# Altium project Acoustics Board.PrjPcb (part 1 of 2)
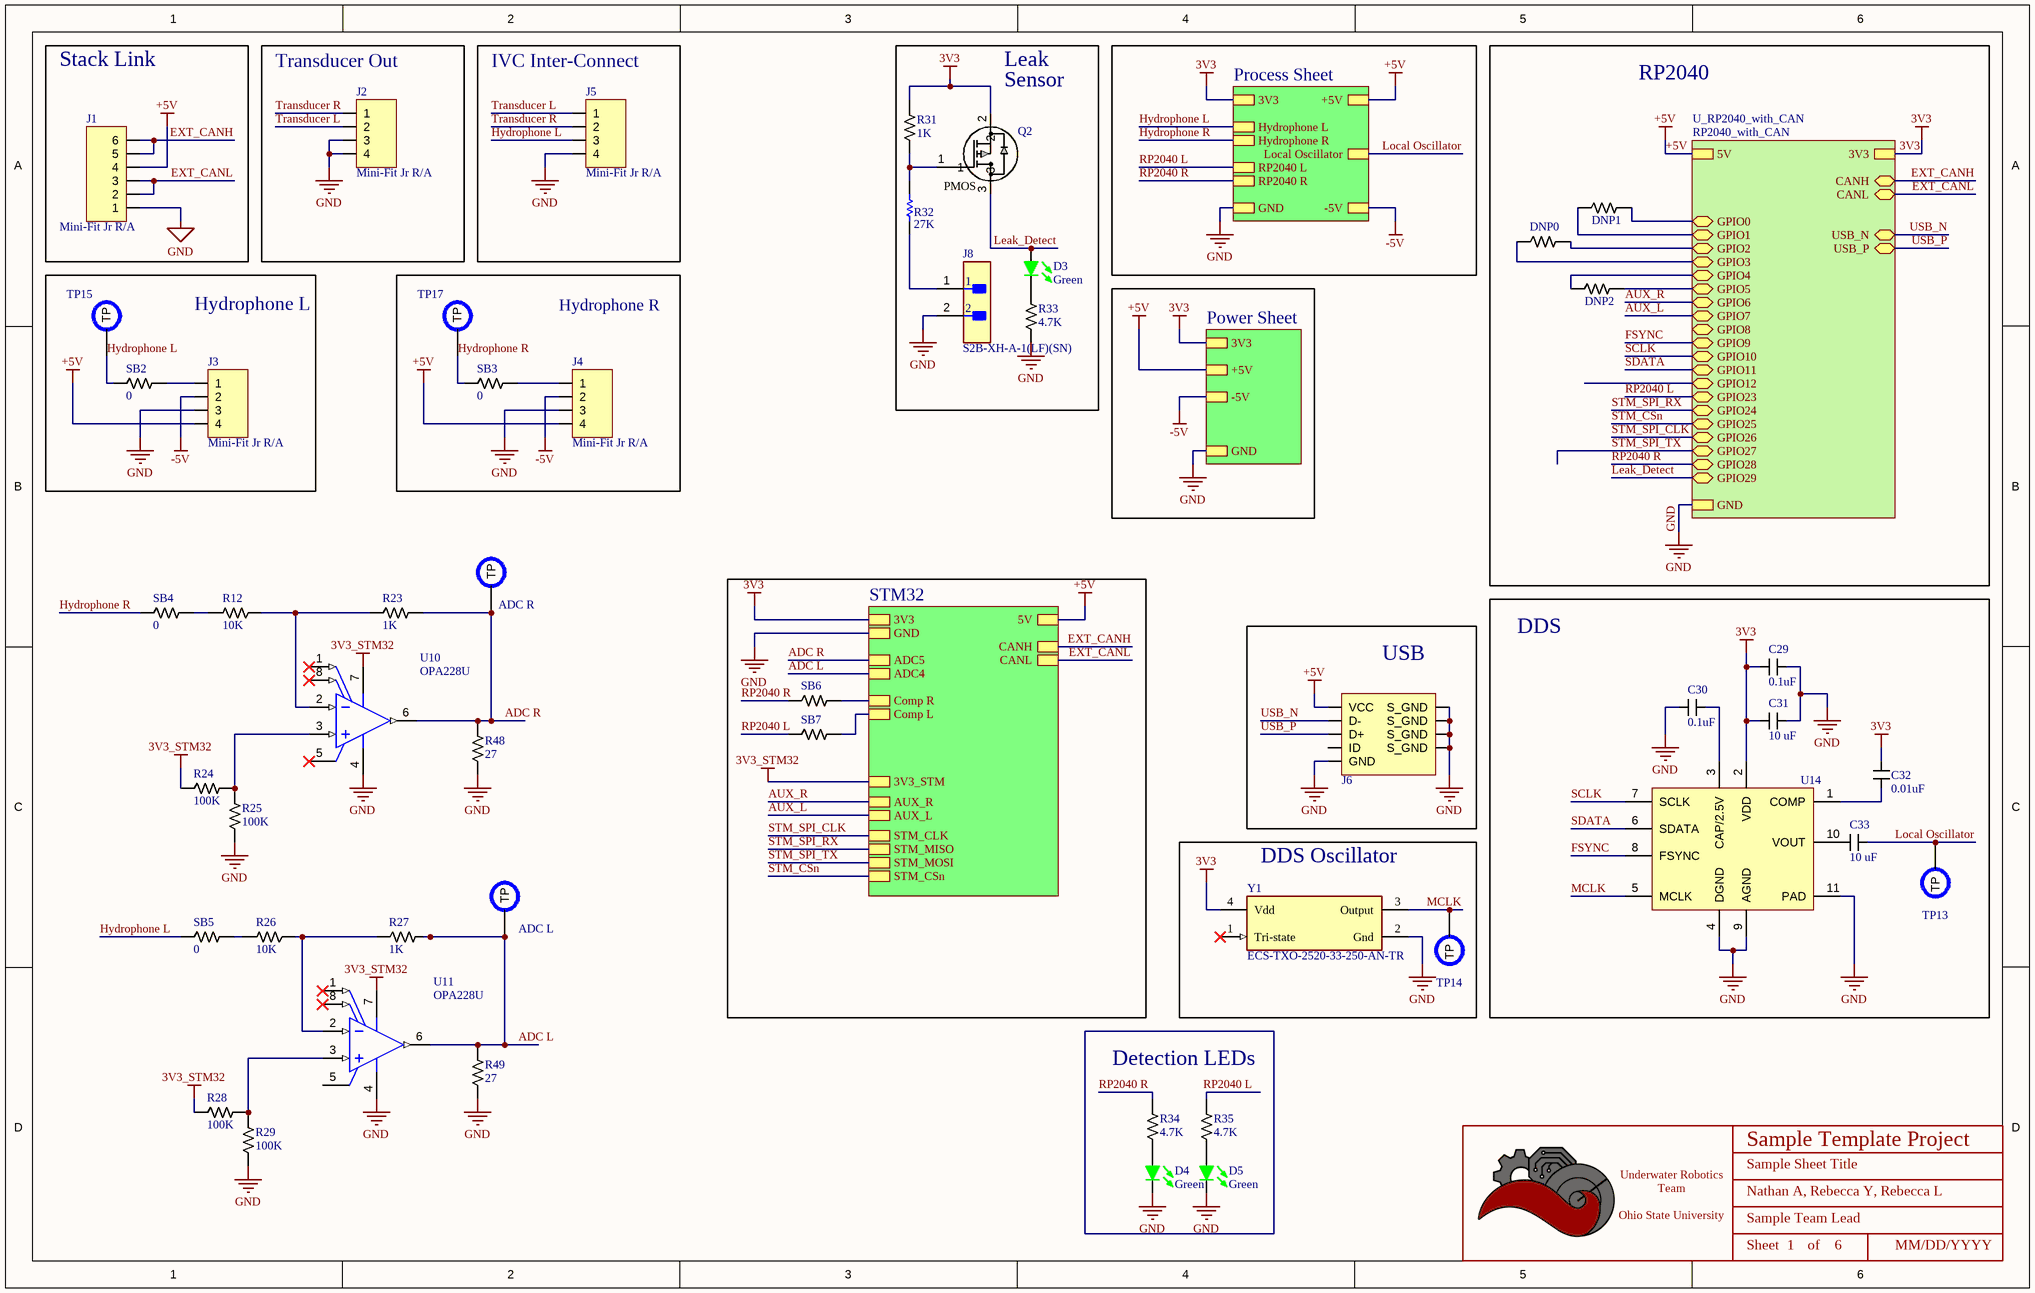
[diagram p0: [Acoustics] Connections & RP2040.SchDoc]
BoardRevision: 1.0; DateOfDesignReview: XX/XX/XXXX; ProjectTitle: Sample Template Project; TeamLead: Sample Team Lead
4 sheets, 201 parts. Net scope: strictly hierarchical (ports join the sheet entries above them; power ports are local).
Board file: Acoustics Board.PcbDoc
Sheets:
  [Acoustics] Connections & RP2040.SchDoc
    Process Sheet = [Acoustics] Hydrophone Process.SchDoc
    Power Sheet = [Acoustics] Power.SchDoc
    STM32 = [Acoustics] STM32G4.SchDoc

## Sheet [Acoustics] Connections & RP2040.SchDoc: Sample Sheet Title
size B; Date: MM/DD/YYYY; Author: Nathan A, Rebecca Y, Rebecca L; Organization: ORGANIZATION; Address1: ADDRESS 1; Address2: ADDRESS 2; Address3: ADDRESS 3; Address4: ADDRESS 4; Revision: -; SheetNumber: 1; SheetTotal: 6; ENG_APP_DATE: --/--/--; DSN_APP_DATE: --/--/--; CHK_APP_DATE: --/--/--

### Parts
(Parts that share a designator on the sheet are numbered #1, #2 ... from top to bottom, then left to right.)
*#1  Title_Block  [LOGO]  (value not drawn)  (graphical)
ADC_L  PCB Test Point  [TESTPOINT_1.2MM]  (value not drawn)  (no BOM)
ADC_R  PCB Test Point  [TESTPOINT_1.2MM]  (value not drawn)  (no BOM)
C29  value 0.1uF  [CAPACITOR_0603]  (hidden comment: 100nF Ceramic 6.3V)
C30  value 0.1uF  [CAPACITOR_0603]  (hidden comment: 100nF Ceramic 6.3V)
C31  Value (uF): 10 uF  [CAPACITOR_0603]  (hidden comment: 10uF Ceramic 6.3V)
C32  value 0.01uF  [CAPACITOR_0603]  (hidden comment: CL10B103KB8NNNC)
C33  Value (uF): 10 uF  [CAPACITOR_0603]  (hidden comment: 10uF Ceramic 6.3V)
D3  Color: Green  [LED_0603]  (hidden comment: IN-S63AT5G)
D4  Color: Green  [LED_0603]  (hidden comment: IN-S63AT5G)
D5  Color: Green  [LED_0603]  (hidden comment: IN-S63AT5G)
DNP0  DNP  [RESISTOR_0402]  (value not drawn)
DNP1  DNP  [RESISTOR_0402]  (value not drawn)
DNP2  DNP  [RESISTOR_0402]  (value not drawn)
J1  Mini-Fit Jr R/A  [CONN_MOLEX_MINIFIT JR_6 POS_R/A]
J2  Mini-Fit Jr R/A  [CONN_MOLEX_MINIFIT JR_4 POS_R/A]
J3  Mini-Fit Jr R/A  [CONN_MOLEX_MINIFIT JR_4 POS_R/A]
J4  Mini-Fit Jr R/A  [CONN_MOLEX_MINIFIT JR_4 POS_R/A]
J5  Mini-Fit Jr R/A  [CONN_MOLEX_MINIFIT JR_4 POS_R/A]
J6  USB_MICRO R/A  [CONN_MINIUSB]  (value not drawn)
J8  S2B-XH-A-1(LF)(SN)  [FP-S2B-XH-A-1_LF_SN-MFG]
Q2  MOSFET P-CHANNEL 20V 4.7A SOT23  [SOT-23-3]  (value not drawn)
R12  Value  (Ohms): 10K  [RESISTOR_0603]  (hidden comment: 10k Ohm 5% 1/10W)
R23  Value  (Ohms): 1K  [RESISTOR_0603]  (hidden comment: 1k Ohm 5% 1/8W)
R24  Value  (Ohms): 100K  [RESISTOR_0603]  (hidden comment: 100k Ohm 5% 1/8W)
R25  Value  (Ohms): 100K  [RESISTOR_0603]  (hidden comment: 100k Ohm 5% 1/8W)
R26  Value  (Ohms): 10K  [RESISTOR_0603]  (hidden comment: 10k Ohm 5% 1/10W)
R27  Value  (Ohms): 1K  [RESISTOR_0603]  (hidden comment: 1k Ohm 5% 1/8W)
R28  Value  (Ohms): 100K  [RESISTOR_0603]  (hidden comment: 100k Ohm 5% 1/8W)
R29  Value  (Ohms): 100K  [RESISTOR_0603]  (hidden comment: 100k Ohm 5% 1/8W)
R31  Value  (Ohms): 1K  [RESISTOR_0402]  (hidden comment: 1k Ohm 1% 1/16W)
R32  27K  [RESC1005X40X25ML05T05]
R33  Value  (Ohms): 4.7K  [RESISTOR_0603]  (hidden comment: 4.7k Ohm 5% 1/10W)
R34  Value  (Ohms): 4.7K  [RESISTOR_0603]  (hidden comment: 4.7k Ohm 5% 1/10W)
R35  Value  (Ohms): 4.7K  [RESISTOR_0603]  (hidden comment: 4.7k Ohm 5% 1/10W)
R48  Value  (Ohms): 27  [RESISTOR_0603]  (hidden comment: 27 Ohm 5% 1/8W)
R49  Value  (Ohms): 27  [RESISTOR_0603]  (hidden comment: 27 Ohm 5% 1/8W)
SB2  Value  (Ohms): 0  [RESISTOR_0603]  (hidden comment: 0 Ohm Jumper No Fit)
SB3  Value  (Ohms): 0  [RESISTOR_0603]  (hidden comment: 0 Ohm Jumper No Fit)
SB4  Value  (Ohms): 0  [RESISTOR_0603]  (hidden comment: 0 Ohm Jumper No Fit)
SB5  Value  (Ohms): 0  [RESISTOR_0603]  (hidden comment: 0 Ohm Jumper No Fit)
SB6  0 Ohm Jumper No Fit  [RESISTOR_0603]  (value not drawn)
SB7  0 Ohm Jumper No Fit  [RESISTOR_0603]  (value not drawn)
TP13  PCB Test Point  [TESTPOINT_1.2MM]  (value not drawn)  (no BOM)
TP14  PCB Test Point  [TESTPOINT_1.2MM]  (value not drawn)  (no BOM)
TP15  PCB Test Point  [TESTPOINT_1.2MM]  (value not drawn)  (no BOM)
TP17  PCB Test Point  [TESTPOINT_1.2MM]  (value not drawn)  (no BOM)
U10  OPA228U  [D0008A_M]
U11  OPA228U  [D0008A_M]
U14  IC DDS 5MHZ 10BIT 10LFCSP  [CP-10-9]  (value not drawn)
Y1  ECS-TXO-2520-33-250-AN-TR  [FP-ECS-TXO-2520-MFG]

### Blocks framed on the sheet
Stack Link: J1
Transducer Out: J2
IVC Inter-Connect: J5
RP2040: DNP0-DNP2
Hydrophone L: J3 SB2 TP15
Hydrophone R: J4 SB3 TP17
DDS: C29-C33 TP13 U14
USB: J6
DDS Oscillator: TP14 Y1

### Sub-sheets
Power Sheet = [Acoustics] Power.SchDoc: 3V3, -5V, GND, +5V
Process Sheet = [Acoustics] Hydrophone Process.SchDoc: Hydrophone L, Hydrophone R, RP2040 L, RP2040 R, 3V3, +5V, -5V, GND, Local Oscillator
STM32 = [Acoustics] STM32G4.SchDoc: 3V3, GND, ADC5, ADC4, 5V, CANH, CANL, Comp R, Comp L, 3V3_STM, AUX_R, AUX_L, STM_CLK, STM_MISO, STM_MOSI, STM_CSn
U_RP2040_with_CAN = RP2040_with_CAN (file not in this document): USB_P (bidir), USB_N (bidir), 5V, CANH (bidir), CANL (bidir), GPIO0 (bidir), GPIO1 (bidir), GPIO2 (bidir), GPIO3 (bidir), GPIO4 (bidir), GPIO5 (bidir), GPIO6 (bidir), GPIO7 (bidir), GPIO8 (bidir), GPIO9 (bidir), GPIO10 (bidir), GPIO11 (bidir), GPIO12 (bidir), GPIO23 (bidir), GPIO24 (bidir), GPIO25 (bidir), GPIO26 (bidir), GPIO27 (bidir), GPIO28 (bidir), GPIO29 (bidir), 3V3, GND

### Nets
3V3: C29.2 C31.1 C32.1 Q2.2 R31.1 U14.2(VDD) Y1.4(Vdd) ; sheet U_RP2040_with_CAN/3V3, sheet Process Sheet/3V3, sheet Power Sheet/3V3, sheet STM32/3V3
3V3_STM32: R24.2 R28.2 U10.7(V+) U11.7(V+) ; sheet STM32/3V3_STM
+5V: J1.4 J3.4 J4.4 J6.1(VCC) ; sheet U_RP2040_with_CAN/5V, sheet Process Sheet/+5V, sheet Power Sheet/+5V, sheet STM32/5V
-5V: J3.2 J4.2 ; sheet Process Sheet/-5V, sheet Power Sheet/-5V
GND: C29.1 C30.1 C31.2 D4.2 D5.2 J1.1 J2.3 J2.4 J3.3 J4.3 J5.4 J6.5(GND) J6.6(S_GND) J6.7(S_GND) J6.8(S_GND) J6.9(S_GND) J8.2 R25.2 R29.2 R33.2 R48.2 R49.2 U10.4(V-) U11.4(V-) U14.4(DGND) U14.9(AGND) U14.11(PAD) Y1.2(Gnd) ; sheet U_RP2040_with_CAN/GND, sheet Process Sheet/GND, sheet Power Sheet/GND, sheet STM32/GND
ADC L: ADC_L.TP R27.1 R49.1 U11.6(OUT) ; sheet STM32/ADC4
ADC R: ADC_R.TP R23.1 R48.1 U10.6(OUT) ; sheet STM32/ADC5
AUX_L: sheet U_RP2040_with_CAN/GPIO7, sheet STM32/AUX_L
AUX_R: sheet U_RP2040_with_CAN/GPIO6, sheet STM32/AUX_R
EXT_CANH: J1.5 J1.6 ; sheet U_RP2040_with_CAN/CANH, sheet STM32/CANH  [project net CANH_STM]
EXT_CANL: J1.2 J1.3 ; sheet U_RP2040_with_CAN/CANL, sheet STM32/CANL  [project net CANL_STM]
FSYNC: U14.8(FSYNC) ; sheet U_RP2040_with_CAN/GPIO9
Hydrophone L: J5.3 SB2.2 SB5.2 TP15.TP ; sheet Process Sheet/Hydrophone L
Hydrophone R: SB3.2 SB4.2 TP17.TP ; sheet Process Sheet/Hydrophone R
Leak_Detect: D3.1 Q2.3 ; sheet U_RP2040_with_CAN/GPIO29
Local Oscillator: C33.2 TP13.TP ; sheet Process Sheet/Local Oscillator
MCLK: TP14.TP U14.5(MCLK) Y1.3(Output)
RP2040 L: R35.1 SB7.2 ; sheet U_RP2040_with_CAN/GPIO23, sheet Process Sheet/RP2040 L
RP2040 R: R34.1 SB6.2 ; sheet U_RP2040_with_CAN/GPIO28, sheet Process Sheet/RP2040 R
SCLK: U14.7(SCLK) ; sheet U_RP2040_with_CAN/GPIO10
SDATA: U14.6(SDATA) ; sheet U_RP2040_with_CAN/GPIO11
STM_CSn: sheet U_RP2040_with_CAN/GPIO25, sheet STM32/STM_CSn
STM_SPI_CLK: sheet U_RP2040_with_CAN/GPIO26, sheet STM32/STM_CLK  [project net SPI1_CLK]
STM_SPI_RX: sheet U_RP2040_with_CAN/GPIO24, sheet STM32/STM_MISO  [project net SPI1_MISO]
STM_SPI_TX: sheet U_RP2040_with_CAN/GPIO27, sheet STM32/STM_MOSI  [project net SPI1_MOSI]
Transducer L: J2.2 J5.1
Transducer R: J2.1 J5.2
USB_N: J6.2(D-) ; sheet U_RP2040_with_CAN/USB_N
USB_P: J6.3(D+) ; sheet U_RP2040_with_CAN/USB_P
NetC30_2: C30.2 U14.3(CAP/2.5V)
NetC32_2: C32.2 U14.1(COMP)
NetC33_1: C33.1 U14.10(VOUT)
NetD3_2: D3.2 R33.1
NetD4_1: D4.1 R34.2
NetD5_1: D5.1 R35.2
NetDNP0_1: DNP0.1 ; sheet U_RP2040_with_CAN/GPIO2
NetDNP0_2: DNP0.2 ; sheet U_RP2040_with_CAN/GPIO3
NetDNP1_1: DNP1.1 ; sheet U_RP2040_with_CAN/GPIO0
NetDNP1_2: DNP1.2 ; sheet U_RP2040_with_CAN/GPIO1
NetDNP2_1: DNP2.1 ; sheet U_RP2040_with_CAN/GPIO5
NetDNP2_2: DNP2.2 ; sheet U_RP2040_with_CAN/GPIO4
NetDNP14_1: SB6.1 ; sheet STM32/Comp R
NetDNP14_2: SB7.1 ; sheet STM32/Comp L
NetJ3_1: J3.1 SB2.1
NetJ4_1: J4.1 SB3.1
NetJ8_1: J8.1 R32.1
NetQ2_1: Q2.1 R31.2 R32.2
NetR12_1: R12.1 SB4.1
NetR12_2: R12.2 R23.2 U10.2(IN-)
NetR24_1: R24.1 R25.1 U10.3(IN+)
NetR26_1: R26.1 SB5.1
NetR26_2: R26.2 R27.2 U11.2(IN-)
NetR28_1: R28.1 R29.1 U11.3(IN+)

Not connected (* = marked no-connect by the designer): J6 4(ID); U10 1(TRIM)* 5(NC)* 8(TRIM)*; U11 1(TRIM)* 5(NC) 8(TRIM)*; Y1 1(Tri-state)*

### Notes on the sheet
- Leak
- (near Q2) Sensor
- Detection LEDs
- DWG. NO.
- REV.
- SHT.
- THIS DOCUMENT AND THE DATA DISCLOSED HEREIN OR HEREWITH IS THE PROPERTY OF ALTIUM LIMITED AND MAY BE FREELY DISTRIBUTED IN WHOLE. NO RIGHTS ARE RESERVED OR EXPRESS OR IMPLIED WARANTEE GIVEN.
- REVISION
- DESCRIPTION
- DATE
- APPROVED
- ENG:
- APPROVALS
- PROJECT
- DSN:
- CHK:
- REFERENCE DOCUMENTS
- PROJECT REVISION:
- TITLE
- DOCUMENT REVISION:
- DESIGN ITEM:
- BOM:
- FAB DWG:
- PCB DWG:
- ASSY DWG:
- SCALE:
- SIZE
- B
- CAGE CODE
- FILE NAME
- DWG NO.
- SHEET
- OF
- REV
- (in symbol Title_Block) Underwater Robotics Team / Ohio State University; Sheet; of
- (in symbol TSM500P02CX) PMOS

### Library data of the parts
*#1 = Title_Block: UWRT Schematic Title Block Template / Created June 2021, Dylan Trainor
ADC_L ADC_R TP13-TP15 TP17 = TESTPOINT: Made By: Robert Pafford
C29 C30 = CAPACITOR_0.1uF_0603: Cap 100nF 6.3V +/-10% / Ceramic 0603; Made By: Flip B; ComponentLink1Description: Datsheet; ComponentLink1URL: https://www.mouser.com/datasheet/2/212/KEM_C1002_X7R_SMD-1102033.pdf; Tolerance: +/- 10%; Voltage: 6.3V; Supplier 1: Digi-Key; Supplier Part Number 1: 399-15351-1-ND
C31 C33 = CAPACITOR_10uF_0603: Cap 10uF 6.3V +/-20% / Ceramic 0603; Made By: Flip B; ComponentLink1Description: Digikey; ComponentLink1URL: https://www.digikey.com/en/products/detail/samsung-electro-mechanics/CL10A106MQ8NNNC/3886777; Supplier 1: Digi-Key; Supplier Part Number 1: 1276-1119-1-ND; Tolerance: +/- 20%; Voltage: 6.3V
C32 = CAPACITOR_0.01uF_0603_50V: 10000 pF ±10% 50V Ceramic Capacitor X7R 0603 (1608 Metric); Tolerance: +/- 10%; Voltage: 6.3V; Made By: Flip B; ComponentLink1Description: Datsheet; ComponentLink1URL: https://www.mouser.com/datasheet/2/212/KEM_C1002_X7R_SMD-1102033.pdf; Supplier 1: Arrow Electronics; Supplier Part Number 1: CL10B103KB8NNNC
D3-D5 = LED_Green_0603_3V: LED Green Vf= 3V If = 0.005A / IN-S63AT5G; Made By: Robert Pafford; Forward Current: 5mA; ComponentLink1Description: Datasheet; ComponentLink1URL: https://www.we-online.de/katalog/datasheet/150060GS75000.pdf; Forward Voltage: 3V; Package: 0603; Supplier 1: Digi-Key; Supplier Part Number 1: 1830-1062-1-ND
DNP0-DNP2 = DNP_0402: Do Not Populate 0402
J1 = CONN_MOLEX_MINIFIT JR_6POS_R/A: Molex Minifit Jr. 5569 / 6 Pos R/A Natural; Pitch: 4.2mm; Configuration: Right Angle; Current Per Pin: 13A; Number of Positions: 8; Manufacturer: Molex; Color: Natural; Created By: Flip B; ComponentLink1Description: Datasheet; ComponentLink1URL: https://www.molex.com/pdm_docs/ps/PS-5556-001.pdf; Series: Minifit Jr 5569; Supplier 1: Digi-Key; Supplier Part Number 1: WM1353-ND
J2-J5 = CONN_MOLEX_MINIFIT JR_4POS_R/A: Molex Minifit Jr. 5569 / 4 Pos R/A Natural; Pitch: 4.2mm; Configuration: Right Angle; Current Per Pin: 13A; Number of Positions: 4; Supplier Part Number 1: WM13112-ND; Supplier 1: Digi-Key; Manufacturer: Molex; Color: Natural; Created By: Flip B; ComponentLink1Description: Datasheet; ComponentLink1URL: https://www.molex.com/pdm_docs/sd/026013115_sd.pdf; Series: Minifit Jr 5569
J6 = CONN_MICROUSB: Amphenol Micro USB-B / USB2.0 5 Pin Right Angle SMD; Pitch: 0.65mm; Current Per Pin: 1.8A; Number of Positions: 5; Manufacturer: Amphenol; Configuration: Right Angle; Color: Silver; Created By: Flip B; ComponentLink1Description: Datasheet; ComponentLink1URL: https://cdn.amphenol-icc.com/media/wysiwyg/files/documentation/datasheet/inputoutput/io_usb_micro.pdf?__cf_chl_jschl_tk__=05693735e19256298f6ef6ca2bb2e65c376a4f56-1625503833-0-Abitsb0-ufjOXJYs_S3J3r2iTn-nObalbmXUksF1VvO_h_WEmRdMlUD1I8-hmWSEVWzY1pirKnrPZWfgY3851qyBZe5ZvnNQePLGIzUgdEIQBVUyW36RsbYpDLEWxJ4horD-5gChFgobLYqwmG5aHl0E8lIn_twwPPrOxilK2gP0q9t_CNOs_u5fMqXvXUrlsOv8tIE2NRlu6NVP8qtkL2GjhlkeTUbDMF8WvvpPDTFOgvZ4Y16Ej8F8AhWos88mo5B1HssXozw0XrkJQIqERITUu6rqloz9kf4ZzhBHtDAt-IkiAFY_Ds9SW8FYKKTtINJVpHZQ6Gyu1FFM4Dc9MO0maE8_mmNcwlxqyRoRk_MPWW8VyByXWM5RSp52jteRKw7FeI9WIYvCbPAOy0Eyib-aseIQsnGbglBcUY6_2xp8GYaJM38H3dNvBPsSOfJBPndKedwKHllxjkucXn6xsN0sDXkpGN-cu8_2bDTJ0g-uUucKSCooYX-ApSDNGpkA_p9zv1SOAD8c0zaZVmtiBsN75QpVz2rzq9_BFxOywPvR; Series: 10118192; Supplier 1: Digi-Key; Supplier Part Number 1: 609-4613-1-ND
J8 = CMP-17439-000260-1: CONN HEADER R/A 2POS 2.5MM; Voltage Rating: 250V; Number of Positions: 2; Contact Material: Brass; Series: XH; Contact Finish - Mating: TIN; Max Operating Temperature: 85°C; Number of Rows: 1; Packaging: Bulk; Insulation Color: Natural; Lead Free: Lead Free; Fastening Type: Detent; Termination: Press-Fit; Connector Type: Header; Insulation Material: Nylon; Contact Shape: Square; Contact Type: Male Pin; Mount: Through Hole; Min Operating Temperature: -25°C; Flammability Rating: UL94 V-0
Q2 = TSM500P02CX: P-Channel 20 V 4.7A (Tc) 1.56W (Tc) Surface Mount SOT-23; Vendor: Taiwan Semiconductor Corporation; Vgs (Max): ±10V; Vgs (th): 800mV @ 250µA; Rds (on): 50mOhm @ 3A, 4.5V; Amp Rating: 4.7 A; FET Type: P-Channel; Package: TO-236-3, SC-59, SOT-23-3; Manufacturer_Part_Number: TSM500P02CX; Vdss: 20 V; Power Dissipation: 1.56W (Tc); Created By: Robert Pafford; Supplier 1: Digi-Key; Supplier Part Number 1: TSM500P02CXRFGCT-ND
R12 R26 = RESISTOR_10K_0603: RES 10k OHM 5% 1/10W 0603; Tolerance: +/- 5%; Wattage: 1/8W; Made By: Robert Pafford; ComponentLink1Description: Datasheet; ComponentLink1URL: https://www.bourns.com/docs/product-datasheets/CRxxxxx.pdf; Supplier: Digikey; Digikey Part Numer: CR0603-JW-104ELFTR-ND; Supplier 1: Digi-Key; Supplier Part Number 1: 2019-RK73B1JTTD103JCT-ND
R23 R27 = RESISTOR_1K_0603: RES 1k OHM 5% 1/8W 0603; Tolerance: +/- 5%; Made By: Robert Pafford; ComponentLink1Description: Datasheet; ComponentLink1URL: https://www.bourns.com/docs/product-datasheets/CRxxxxx.pdf; Wattage: 1/8W; Supplier: Digikey; Digikey Part Numer: CR0603-JW-104ELFTR-ND; Supplier 1: Digi-Key; Supplier Part Number 1: 2019-RK73B1JTTD102JCT-ND
R24 R25 R28 R29 = RESISTOR_100K_0603: RES 100k OHM 5% 1/10W 0603; Tolerance: +/- 5%; Made By: Flip B; ComponentLink1Description: Datasheet; ComponentLink1URL: https://www.bourns.com/docs/product-datasheets/CRxxxxx.pdf; Wattage: 1/10W; Supplier: Digikey; Digikey Part Numer: CR0603-JW-104ELFTR-ND; Supplier 1: Digi-Key; Supplier Part Number 1: CR0603-JW-104ELFCT-ND
R31 = RESISTOR_1K_0402: RES 1k OHM 1% 1/16W 0402; Tolerance: +/- 1%; Made By: Robert Pafford; Wattage: 1/16W; Supplier: Digikey; Digikey Part Numer: CR0603-JW-104ELFTR-ND; Supplier 1: Digi-Key; Supplier Part Number 1: 13-AC0402FR-131KLCT-ND
R32 = CMP-2002-00501-1: RES SMD 27K OHM 5% 1/10W 0402ERJ-2GEJ273X; Manufacturer: Panasonic; Part Number: ERJ-2GEJ273X
R33-R35 = RESISTOR_4.7K_0603: RES 4.7k OHM 5% 1/10W 0603; Tolerance: +/- 5%; Made By: Robert Pafford; Wattage: 1/10W; Supplier: Digikey; Digikey Part Numer: CR0603-JW-104ELFTR-ND; Supplier 1: Digi-Key; Supplier Part Number 1: RMCF0603JT4K70CT-ND
R48 R49 = RESISTOR_27_0603: RES 27 OHM 5% 1/8W 0603; Tolerance: +/- 5%; Made By: Robert Pafford; ComponentLink1Description: Datasheet; ComponentLink1URL: https://www.bourns.com/docs/product-datasheets/CRxxxxx.pdf; Wattage: 1/8W; Supplier: Digikey; Digikey Part Numer: CR0603-JW-104ELFTR-ND; Supplier 1: Digi-Key; Supplier Part Number 1: 2019-RK73B1JTTD270JCT-ND
SB2-SB5 = JUMPER_0_0603: 0 Ohm Jumper No Fit for Solder Bridge; Made By: Robert Pafford; ComponentLink1Description: Digikey; ComponentLink1URL: https://www.digikey.com/en/products/detail/koa-speer-electronics-inc/RK73B1JTTD101J/9844701
SB6 SB7 = JUMPER_0_0603: 0 Ohm Jumper No Fit for Solder Bridge; Made By: Robert Pafford; Value  (Ohms): 0; ComponentLink1Description: Digikey; ComponentLink1URL: https://www.digikey.com/en/products/detail/koa-speer-electronics-inc/RK73B1JTTD101J/9844701
U10 U11 = CMP-0272-00518-3: High Precision, Low Noise Operational Amplifier, 5 to 36 V, -55 to 125 degC, 8-pin SOIC (D8), Green (RoHS & no Sb/Br); Manufacturer: Texas Instruments; Slew Rate(Typ)(V/us): 11; Sub Family: High Supply Voltage Amplifier (>=30V), Low Noise Amp (<=10nV/rtHz), Low Offset Voltage Amplifier (<=500uV), Precision Amplifier; Total Supply Voltage(Min)(+5V is 5, +/-5V is 10): 5; Vio (25C)(Max)(mV): 0.075; IIB(Max)(pA): 10000; Total Supply Voltage(Max)(+5V is 5, +/-5V is 10): 36; Number of Channels: 1; Offset Drift(Typ)(uV/C): 0.1; Packing: TUBE; CMRR(Min)(dB): 120; Rating: Catalog; GBW(Typ)(MHz): 33; Iq per channel(Max)(mA): 3.8; Eco-Plan: Green (RoHS & no Sb/Br); ComponentLink3URL: http://www.ti.com/litv/pdf/msoi002j; Code_JEDEC: MS-012; ComponentLink2Description: Datasheet; PackageReference: D0008A; Mounting Technology: Surface Mount; PackageDescription: 8-Pin Plastic Small Outline, Body 4.9 x 3.9 mm, Pitch 1.27 mm; PartNumber: OPA228U; PackageVersion: 4040047-3/M, 06/2011; DatasheetVersion: SBOS110A; ComponentLink3Description: Package Specification; ComponentLink1Description: Manufacturer URL; ComponentLink2URL: http://www.ti.com/lit/ds/symlink/opa228.pdf; ComponentLink1URL: http://www.ti.com/
U14 = AD9837ACPZ: Direct Digital Synthesis IC 10 b 5 MHz 28 b Tuning 10-LFCSP-WD (3x3)
Y1 = CMP-40224-000034-1: XTAL OSC TCXO 25.0000MHZ HCMOS; RoHS Compliant: Yes

## Sheet [Acoustics] Hydrophone Process.SchDoc: Sample Sheet Title
size B; Date: 10/22/2023; Author: Nathan A, Rebecca Y, Rebecca L; Organization: ORGANIZATION; Address1: ADDRESS 1; Address2: ADDRESS 2; Address3: ADDRESS 3; Address4: ADDRESS 4; Revision: -; SheetNumber: 2; SheetTotal: 6; ENG_APP_DATE: --/--/--; DSN_APP_DATE: --/--/--; CHK_APP_DATE: --/--/--
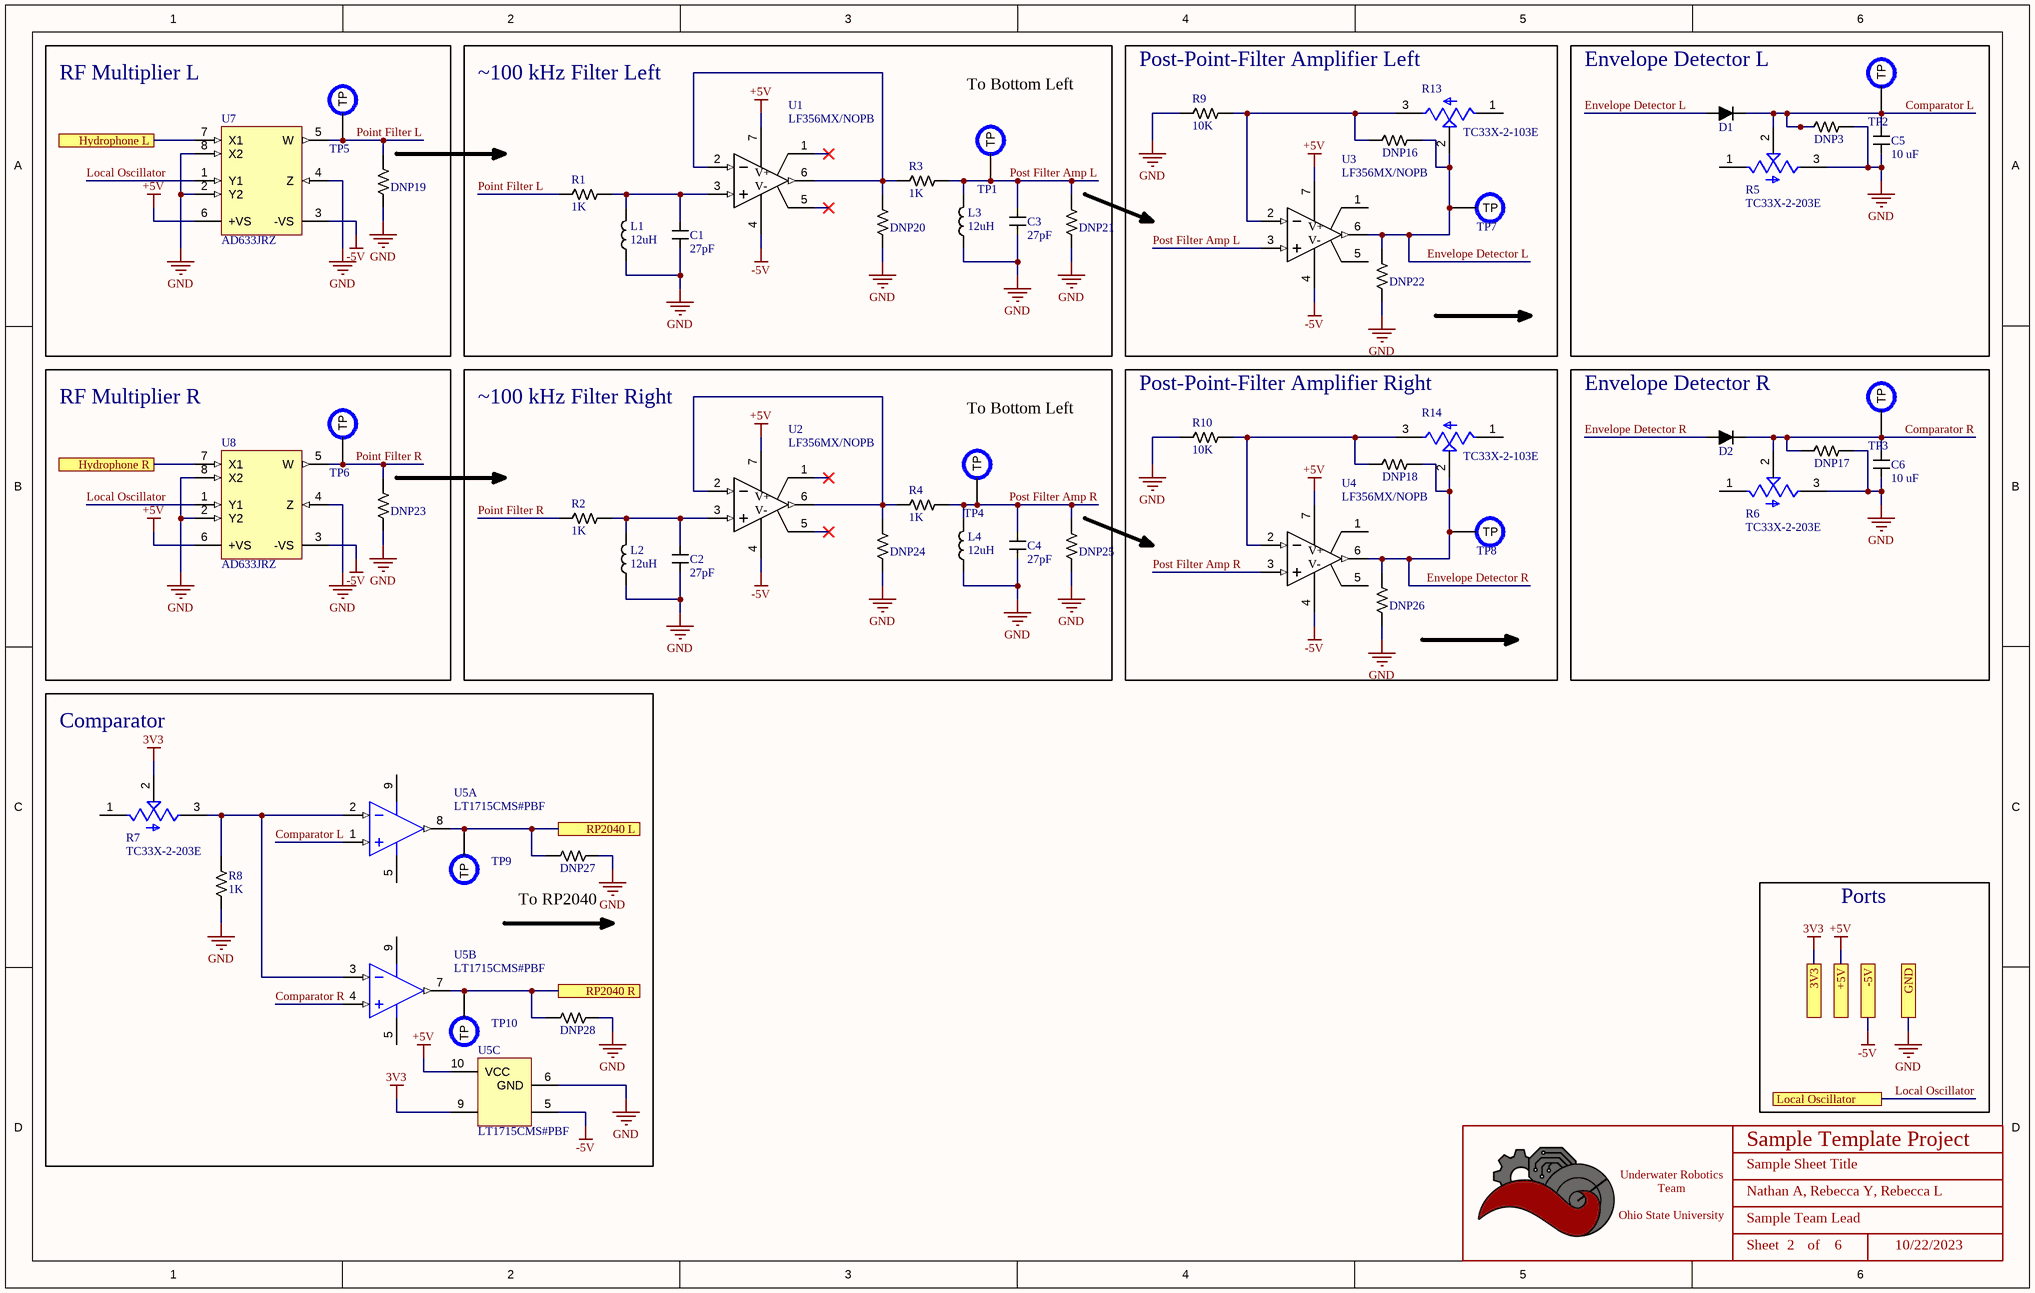
[diagram p1: [Acoustics] Hydrophone Process.SchDoc]

### Parts
(Parts that share a designator on the sheet are numbered #1, #2 ... from top to bottom, then left to right.)
*#2  Title_Block  [LOGO]  (value not drawn)  (graphical)
C1  value 27pF  [CAPACITOR_0603]  (hidden comment: 27pF Ceramic 50V)
C2  value 27pF  [CAPACITOR_0603]  (hidden comment: 27pF Ceramic 50V)
C3  value 27pF  [CAPACITOR_0603]  (hidden comment: 27pF Ceramic 50V)
C4  value 27pF  [CAPACITOR_0603]  (hidden comment: 27pF Ceramic 50V)
C5  Value (uF): 10 uF  [CAPACITOR_0603]  (hidden comment: 10uF Ceramic 6.3V)
C6  Value (uF): 10 uF  [CAPACITOR_0603]  (hidden comment: 10uF Ceramic 6.3V)
D1  BAR9002ELE6327XTMA1  [DIODE_0402]  (value not drawn)
D2  BAR9002ELE6327XTMA1  [DIODE_0402]  (value not drawn)
DNP3  DNP  [RESISTOR_0402]  (value not drawn)
DNP16  DNP  [RESISTOR_0402]  (value not drawn)
DNP17  DNP  [RESISTOR_0402]  (value not drawn)
DNP18  DNP  [RESISTOR_0402]  (value not drawn)
DNP19  DNP  [RESISTOR_0402]  (value not drawn)
DNP20  DNP  [RESISTOR_0402]  (value not drawn)
DNP21  DNP  [RESISTOR_0402]  (value not drawn)
DNP22  DNP  [RESISTOR_0402]  (value not drawn)
DNP23  DNP  [RESISTOR_0402]  (value not drawn)
DNP24  DNP  [RESISTOR_0402]  (value not drawn)
DNP25  DNP  [RESISTOR_0402]  (value not drawn)
DNP26  DNP  [RESISTOR_0402]  (value not drawn)
DNP27  DNP  [RESISTOR_0402]  (value not drawn)
DNP28  DNP  [RESISTOR_0402]  (value not drawn)
L1  value 12uH  [INDUCTOR_0603]  (hidden comment: FIXED IND 12UH 10MA 1.8 OHM SMD)
L2  value 12uH  [INDUCTOR_0603]  (hidden comment: FIXED IND 12UH 10MA 1.8 OHM SMD)
L3  value 12uH  [INDUCTOR_0603]  (hidden comment: FIXED IND 12UH 10MA 1.8 OHM SMD)
L4  value 12uH  [INDUCTOR_0603]  (hidden comment: FIXED IND 12UH 10MA 1.8 OHM SMD)
R1  Value  (Ohms): 1K  [RESISTOR_0603]  (hidden comment: 1k Ohm 5% 1/8W)
R2  Value  (Ohms): 1K  [RESISTOR_0603]  (hidden comment: 1k Ohm 5% 1/8W)
R3  Value  (Ohms): 1K  [RESISTOR_0603]  (hidden comment: 1k Ohm 5% 1/8W)
R4  Value  (Ohms): 1K  [RESISTOR_0603]  (hidden comment: 1k Ohm 5% 1/8W)
R5  TC33X-2-203E  [TRIM_TC33X-2-203E]
R6  TC33X-2-203E  [TRIM_TC33X-2-203E]
R7  TC33X-2-203E  [TRIM_TC33X-2-203E]
R8  Value  (Ohms): 1K  [RESISTOR_0402]  (hidden comment: 1k Ohm 1% 1/16W)
R9  Value  (Ohms): 10K  [RESISTOR_0603]  (hidden comment: 10k Ohm 0.5% 1/10W)
R10  Value  (Ohms): 10K  [RESISTOR_0603]  (hidden comment: 10k Ohm 0.5% 1/10W)
R13  TC33X-2-103E  [TRIM_TC33X-2-203E]
R14  TC33X-2-103E  [TRIM_TC33X-2-203E]
TP1  PCB Test Point  [TESTPOINT_1.2MM]  (value not drawn)  (no BOM)
TP2  PCB Test Point  [TESTPOINT_1.2MM]  (value not drawn)  (no BOM)
TP3  PCB Test Point  [TESTPOINT_1.2MM]  (value not drawn)  (no BOM)
TP4  PCB Test Point  [TESTPOINT_1.2MM]  (value not drawn)  (no BOM)
TP5  PCB Test Point  [TESTPOINT_1.2MM]  (value not drawn)  (no BOM)
TP6  PCB Test Point  [TESTPOINT_1.2MM]  (value not drawn)  (no BOM)
TP7  PCB Test Point  [TESTPOINT_1.2MM]  (value not drawn)  (no BOM)
TP8  PCB Test Point  [TESTPOINT_1.2MM]  (value not drawn)  (no BOM)
TP9  PCB Test Point  [TESTPOINT_1.2MM]  (value not drawn)  (no BOM)
TP10  PCB Test Point  [TESTPOINT_1.2MM]  (value not drawn)  (no BOM)
U1  LF356MX/NOPB  [SOIC-8]
U2  LF356MX/NOPB  [SOIC-8]
U3  LF356MX/NOPB  [SOIC-8]
U4  LF356MX/NOPB  [SOIC-8]
U5  LT1715CMS#PBF  [LT-MS10_N]  (parts A,B,C of 3)
U7  AD633JRZ  [ADI-R-8_M]
U8  AD633JRZ  [ADI-R-8_M]

### Blocks framed on the sheet
RF Multiplier L: DNP19 TP5 U7
~100 kHz Filter Left: C1 C3 DNP20 DNP21 L1 L3 R1 R3 TP1 U1
Post-Point-Filter Amplifier Left: DNP16 DNP22 R9 R13 TP7 U3
Envelope Detector L: C5 D1 DNP3 R5 TP2
RF Multiplier R: DNP23 TP6 U8
~100 kHz Filter Right: C2 C4 DNP24 DNP25 L2 L4 R2 R4 TP4 U2
Post-Point-Filter Amplifier Right: DNP18 DNP26 R10 R14 TP8 U4
Envelope Detector R: C6 D2 DNP17 R6 TP3
Comparator: DNP27 DNP28 R7 R8 TP9 TP10 U5

### Ports
3V3, +5V, -5V, GND, Hydrophone L, Hydrophone R, Local Oscillator, RP2040 L, RP2040 R

### Nets
3V3: R7.2(W) U5.9(+VS) ; port 3V3
+5V: U1.7(V+) U2.7(V+) U3.7(V+) U4.7(V+) U5.10(VCC) U7.6(+VS) U8.6(+VS) ; port +5V
-5V: U1.4(V-) U2.4(V-) U3.4(V-) U4.4(V-) U5.5(VEE) U7.3(-VS) U8.3(-VS) ; port -5V
GND: C1.2 C2.2 C3.2 C4.2 C5.2 C6.2 DNP3.1 DNP17.1 DNP19.2 DNP20.2 DNP21.2 DNP22.2 DNP23.2 DNP24.2 DNP25.2 DNP26.2 DNP27.2 DNP28.2 L1.2 L2.2 L3.2 L4.2 R5.3(CW) R6.3(CW) R8.2 R9.2 R10.2 U5.6(GND) U7.2(Y2) U7.4(Z) U7.8(X2) U8.2(Y2) U8.4(Z) U8.8(X2) ; port GND
Comparator L: C5.1 D1.2 DNP3.2 R5.2(W) TP2.TP U5.1(+IN_A)
Comparator R: C6.1 D2.2 DNP17.2 R6.2(W) TP3.TP U5.4(+IN_B)
Envelope Detector L: D1.1 DNP16.1 DNP22.1 R13.2(W) TP7.TP U3.6(OUT)
Envelope Detector R: D2.1 DNP18.1 DNP26.1 R14.2(W) TP8.TP U4.6(OUT)
Hydrophone L: U7.7(X1) ; port Hydrophone L
Hydrophone R: U8.7(X1) ; port Hydrophone R
Local Oscillator: U7.1(Y1) U8.1(Y1) ; port Local Oscillator
Point Filter L: DNP19.1 R1.2 TP5.TP U7.5(W)
Point Filter R: DNP23.1 R2.2 TP6.TP U8.5(W)
Post Filter Amp L: C3.1 DNP21.1 L3.1 R3.1 TP1.TP U3.3(IN+)
Post Filter Amp R: C4.1 DNP25.1 L4.1 R4.1 TP4.TP U4.3(IN+)
RP2040 L: DNP27.1 TP9.TP U5.8(OUT_A) ; port RP2040 L
RP2040 R: DNP28.1 TP10.TP U5.7(OUT_B) ; port RP2040 R
NetC1_1: C1.1 L1.1 R1.1 U1.3(IN+)
NetC2_1: C2.1 L2.1 R2.1 U2.3(IN+)
NetDNP16_2: DNP16.2 R9.1 R13.3(CW) U3.2(IN-)
NetDNP18_2: DNP18.2 R10.1 R14.3(CW) U4.2(IN-)
NetDNP20_1: DNP20.1 R3.2 U1.2(IN-) U1.6(OUT)
NetDNP24_1: DNP24.1 R4.2 U2.2(IN-) U2.6(OUT)
NetR7_3: R7.3(CW) R8.1 U5.2(-IN_A) U5.3(-IN_B)

Not connected (* = marked no-connect by the designer): R5 1(CCW); R6 1(CCW); R7 1(CCW); R13 1(CCW); R14 1(CCW); U1 1(Balance)* 5(Balance)*; U2 1(Balance)* 5(Balance)*; U3 1(Balance) 5(Balance); U4 1(Balance) 5(Balance)

### Notes on the sheet
- To Bottom Left
- (near DNP27) To RP2040
- Ports
- DWG. NO.
- REV.
- SHT.
- THIS DOCUMENT AND THE DATA DISCLOSED HEREIN OR HEREWITH IS THE PROPERTY OF ALTIUM LIMITED AND MAY BE FREELY DISTRIBUTED IN WHOLE. NO RIGHTS ARE RESERVED OR EXPRESS OR IMPLIED WARANTEE GIVEN.
- REVISION
- DESCRIPTION
- DATE
- APPROVED
- ENG:
- APPROVALS
- PROJECT
- DSN:
- CHK:
- REFERENCE DOCUMENTS
- PROJECT REVISION:
- TITLE
- DOCUMENT REVISION:
- DESIGN ITEM:
- BOM:
- FAB DWG:
- PCB DWG:
- ASSY DWG:
- SCALE:
- SIZE
- B
- CAGE CODE
- FILE NAME
- DWG NO.
- SHEET
- OF
- REV
- (in symbol Title_Block) Underwater Robotics Team / Ohio State University; Sheet; of

### Library data of the parts
*#2 = Title_Block: as *#1 on sheet [Acoustics] Connections & RP2040
C1-C4 = CAPACITOR_0.000027uF_0603: Cap 27pF 50V +/-5% / Ceramic 0603; Made By: Flip B; Tolerance: +/- 5%; Voltage: 50V; ComponentLink1Description: Datsheet; ComponentLink1URL: https://www.mouser.com/datasheet/2/212/KEM_C1002_X7R_SMD-1102033.pdf; Supplier 1: Digi-Key; Supplier Part Number 1: 311-1063-1-ND
C5 C6 = CAPACITOR_10uF_0603: as C31 on sheet [Acoustics] Connections & RP2040; ComponentLink1Description: Digikey; ComponentLink1URL: https://www.digikey.com/en/products/detail/samsung-electro-mechanics/CL10A106MQ8NNNC/3886777; Supplier 1: Digi-Key; Supplier Part Number 1: 1276-1119-1-ND; Tolerance: +/- 20%; Voltage: 6.3V
D1 D2 = RF Diode 80V 100mA: RF Diode PIN - Single 80V 100 mA 250 mW PG-TSLP-2-19; Forward Current: 100mA; Voltage - Peak Reverse: 80V; Package: 0402
DNP3 DNP16-DNP28 = DNP_0402: Do Not Populate 0402
L1-L4 = INDUCTOR_12uH_0603: 12 µH Shielded Multilayer Inductor 10 mA 1.8Ohm Max 0603 (1608 Metric); Tolerance: +/- 20%; Made By: Robert Pafford; DC Resistance: 36mOhm; Current Rating: 2.1A; Supplier 1: Arrow Electronics; Supplier Part Number 1: MLF1608E120JTD25
R1-R4 = RESISTOR_1K_0603: as R23 on sheet [Acoustics] Connections & RP2040; ComponentLink1Description: Datasheet; ComponentLink1URL: https://www.bourns.com/docs/product-datasheets/CRxxxxx.pdf; Wattage: 1/8W; Supplier: Digikey; Digikey Part Numer: CR0603-JW-104ELFTR-ND; Supplier 1: Digi-Key; Supplier Part Number 1: 2019-RK73B1JTTD102JCT-ND
R5-R7 R13 R14 = TC33X-2-203E: 20 kOhms 0.1W, 1/10W J Lead Surface Mount Trimmer Potentiometer Cermet 1 Turn Top Adjustment; MF: Bourns; Value: *; SnapEDA_Link: https://www.snapeda.com/parts/TC33X-2-203E/Bourns/view-part/312812/?ref=snap; Check_prices: https://www.snapeda.com/parts/TC33X-2-203E/Bourns/view-part/312812/?ref=eda; Digi-Key_Part_Number: TC33X-2-203ECT-ND; Purchase-URL: https://pricing.snapeda.com/search/part/TC33X-2-203E/?ref=eda; Package: 1608 Bourns; MP: TC33X-2-203E; Supplier 1: Mouser; Supplier Part Number 1: 652-TC33X-2-203E
R8 = RESISTOR_1K_0402: as R31 on sheet [Acoustics] Connections & RP2040; Wattage: 1/16W; Supplier: Digikey; Digikey Part Numer: CR0603-JW-104ELFTR-ND; Supplier 1: Digi-Key; Supplier Part Number 1: 13-AC0402FR-131KLCT-ND
R9 R10 = RESISTOR_10K_0.5%_0603: RES 10k OHM 0.5% 1/10W 0603; Tolerance: +/- 0.5%; Made By: Robert Pafford; Wattage: 1/10W; Supplier: Digikey; Digikey Part Numer: CR0603-JW-104ELFTR-ND; Supplier 1: Digi-Key; Supplier Part Number 1: 749-1695-1-ND
TP1-TP10 = TESTPOINT: Made By: Robert Pafford
U1-U4 = LM356MX/NOPB: IC OPAMP JFET 1 CIRCUIT 8SOIC; PartNumber: LM8261M5X/NOPB; Manufacturer: Texas Instruments; Supply Current: 1.3 mA; Supply Voltage: 2.5 V ~ 30 V, +/- 1.25 V ~ 15 V; Gain Bandwidth Product: 21 MHz; Created By: Dylan T; ComponentLink1Description: Digi-Key; ComponentLink1URL: https://www.digikey.com/en/products/detail/texas-instruments/LF356MX-NOPB/366701
U5 = CMP-0360-00164-2: 4 ns, 150 MHz Comparator with Independent Input / Output Supplies, 2 Channels, 2.7 to 12 V, 0 to +70 degC, 10-pin MSOP (MS10); Generic Part Number: LT1715; Manufacturer: Linear Technology; Prop Delay (us): 0.004; Vos (mV) Typical: 0.4; Channels (#): 2; Vs Min (V): 2.7; Supply Current (uA) Typical: 7500; Vos (mV) Guaranteed: 2.5; Vs Max (V): 12; Supply Voltage Range: 2.7 to 12 V; ComponentLink1Description: Manufacturer URL; ComponentLink1URL: http://www.linear.com/; RoHS: Y; ComponentLink2URL: http://cds.linear.com/docs/en/datasheet/1715fa.pdf; Features: Comparator, Separate In/Out Power Supply; Mounting Technology: Surface Mount; ComponentLink3URL: http://cds.linear.com/docs/en/packaging/MSOP_10_05-08-1661.pdf; ComponentLink3Description: Package Specification; PartNumber: LT1715CMS#PBF; PackageReference: MS10; ComponentLink2Description: Datasheet; PackageDescription: 10-Pin MSOP, Body 3 x 3 mm, Pitch 0.5 mm; DatasheetVersion: Rev A
U7 U8 = CMP-1592-00007-1: Low Cost Analog Multiplier, 20 V/us, 6 mA, 0 to 70 degC, 8-Pin SOIC (R), RoHS, Tube; PartNumber: AD633; Supply Current Max: 6 mA; Slew Rate: 20 V/us; Number of Channels: 2; DatasheetVersion: Rev. K; PackageDescription: 8-Pin Small Outline Package, Body 4.9 x 3.9 mm, Pitch 1.27 mm; PackageVersion: 06/2006; ComponentLink3Description: Package Specification; ComponentLink2Description: Datasheet; RoHS: TRUE; Mounting Technology: Surface Mount; ComponentLink1Description: Manufacturer URL; Packing: Tube; Code_JEDEC: MS-012-AA; ComponentLink1URL: http://www.analog.com/en/index.html; Temperature Max: 70 degC; Temperature Min: 0 degC; ComponentLink3URL: http://www.analog.com/media/en/package-pcb-resources/package/pkg_pdf/soic_narrow-r/r_8.pdf; ComponentLink2URL: http://www.analog.com/media/en/technical-documentation/data-sheets/AD633.pdf

## Sheet [Acoustics] Power.SchDoc: Sample Sheet Title
size B; Date: MM/DD/YYYY; Author: Nathan A, Rebecca Y, Rebecca L; Organization: ORGANIZATION; Address1: ADDRESS 1; Address2: ADDRESS 2; Address3: ADDRESS 3; Address4: ADDRESS 4; Revision: -; SheetNumber: 3; SheetTotal: 6; ENG_APP_DATE: --/--/--; DSN_APP_DATE: --/--/--; CHK_APP_DATE: --/--/--
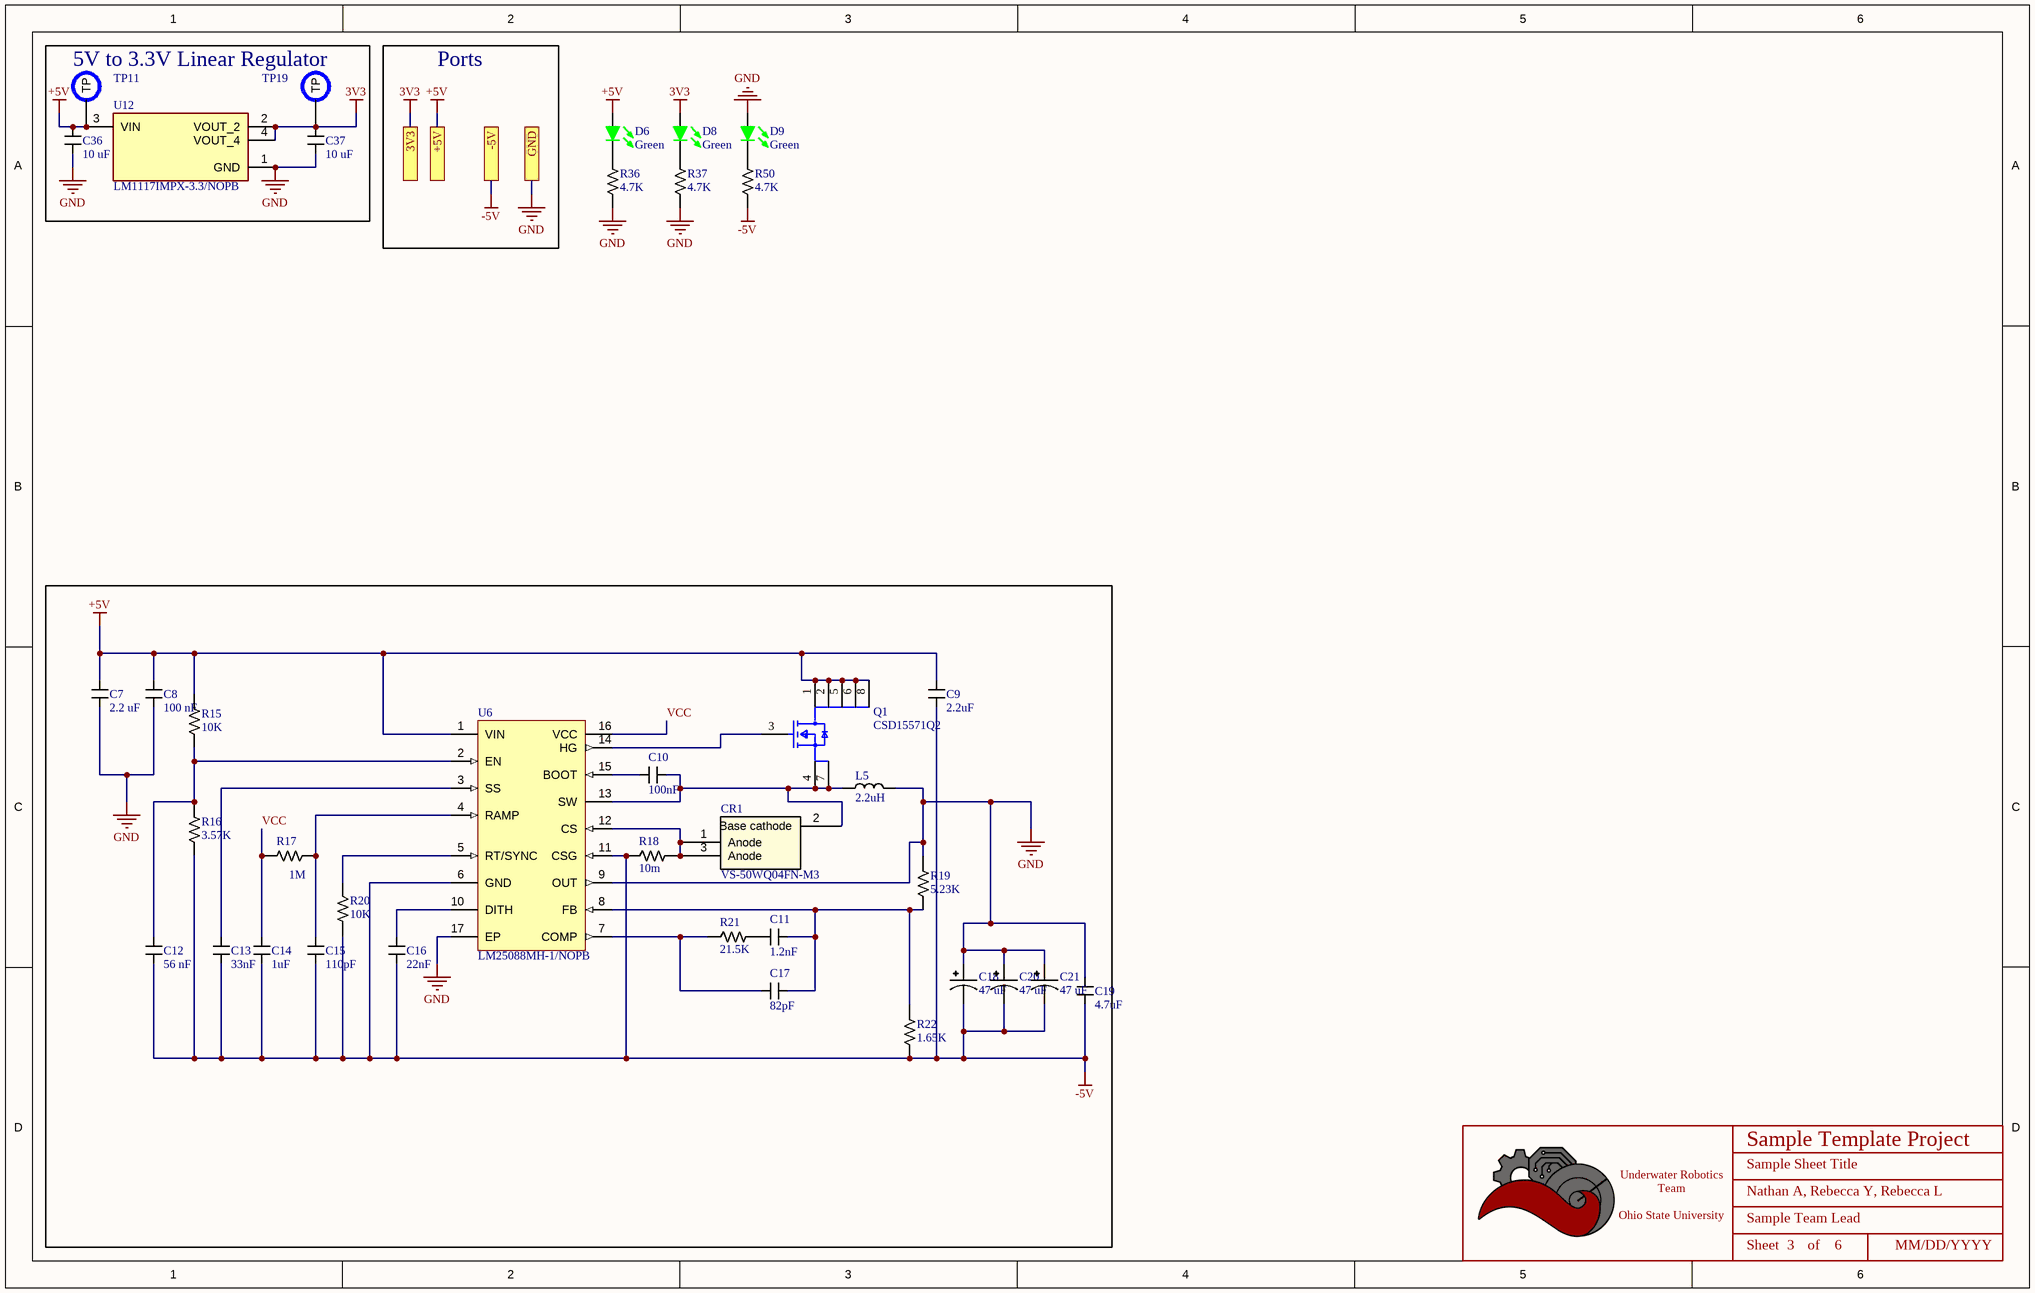
[diagram p2: [Acoustics] Power.SchDoc]

### Parts
(Parts that share a designator on the sheet are numbered #1, #2 ... from top to bottom, then left to right.)
*#3  Title_Block  [LOGO]  (value not drawn)  (graphical)
C7  value 2.2 uF  [CAPACITOR_0402]  (hidden comment: 1uF Ceramic 16V)
C8  value 100 nF  [CAPACITOR_0402]  (hidden comment: 1uF Ceramic 16V)
C9  value 2.2uF  [CAPACITOR_0402]  (hidden comment: 1uF Ceramic 16V)
C10  value 100nF  [CAPACITOR_0402]  (hidden comment: 1uF Ceramic 16V)
C11  value 1.2nF  [CAPACITOR_0402]  (hidden comment: 1uF Ceramic 16V)
C12  value 56 nF  [CAPACITOR_0402]  (hidden comment: 1uF Ceramic 16V)
C13  value 33nF  [CAPACITOR_0402]  (hidden comment: 1uF Ceramic 16V)
C14  value 1uF  [CAPACITOR_0402]  (hidden comment: 1uF Ceramic 16V)
C15  value 110pF  [CAPACITOR_0402]  (hidden comment: 1uF Ceramic 16V)
C16  value 22nF  [CAPACITOR_0402]  (hidden comment: 1uF Ceramic 16V)
C17  value 82pF  [CAPACITOR_0402]  (hidden comment: 1uF Ceramic 16V)
C18  Value (uF): 47 uF  [CAPACITOR_1206 - POLAR]  (hidden comment: 10uF Tantalum 16V)
C19  value 4.7uF  [CAPACITOR_0402]  (hidden comment: 1uF Ceramic 16V)
C20  Value (uF): 47 uF  [CAPACITOR_1206 - POLAR]  (hidden comment: 10uF Tantalum 16V)
C21  Value (uF): 47 uF  [CAPACITOR_1206 - POLAR]  (hidden comment: 10uF Tantalum 16V)
C36  Value (uF): 10 uF  [CAPACITOR_0603]  (hidden comment: 10uF Ceramic 6.3V)
C37  Value (uF): 10 uF  [CAPACITOR_0603]  (hidden comment: 10uF Ceramic 6.3V)
CR1  VS-50WQ04FN-M3  [D2PAK_VIS]
D6  Color: Green  [LED_0603]  (hidden comment: IN-S63AT5G)
D8  Color: Green  [LED_0603]  (hidden comment: IN-S63AT5G)
D9  Color: Green  [LED_0603]  (hidden comment: IN-S63AT5G)
L5  value 2.2uH  [INDUCTOR_0402]  (hidden comment: FIXED IND 15NH 250MA 600MOHM SMD)
Q1  CSD15571Q2  [FP-DQK0006C-MFG]
R15  Value  (Ohms): 10K  [RESISTOR_0402]  (hidden comment: 1k Ohm 1% 1/16W)
R16  Value  (Ohms): 3.57K  [RESISTOR_0402]  (hidden comment: 1k Ohm 1% 1/16W)
R17  Value  (Ohms): 1M  [RESISTOR_0402]  (hidden comment: 1k Ohm 1% 1/16W)
R18  Value  (Ohms): 10m  [RESISTOR_0402]  (hidden comment: 1k Ohm 1% 1/16W)
R19  Value  (Ohms): 5.23K  [RESISTOR_0402]  (hidden comment: 1k Ohm 1% 1/16W)
R20  Value  (Ohms): 10K  [RESISTOR_0402]  (hidden comment: 1k Ohm 1% 1/16W)
R21  Value  (Ohms): 21.5K  [RESISTOR_0402]  (hidden comment: 1k Ohm 1% 1/16W)
R22  Value  (Ohms): 1.65K  [RESISTOR_0402]  (hidden comment: 1k Ohm 1% 1/16W)
R36  Value  (Ohms): 4.7K  [RESISTOR_0603]  (hidden comment: 4.7k Ohm 5% 1/10W)
R37  Value  (Ohms): 4.7K  [RESISTOR_0603]  (hidden comment: 4.7k Ohm 5% 1/10W)
R50  Value  (Ohms): 4.7K  [RESISTOR_0603]  (hidden comment: 4.7k Ohm 5% 1/10W)
TP11  PCB Test Point  [TESTPOINT_1.2MM]  (value not drawn)  (no BOM)
TP19  PCB Test Point  [TESTPOINT_1.2MM]  (value not drawn)  (no BOM)
U6  LM25088MH-1/NOPB  [PWP0016A_N]
U12  LM1117IMPX-3.3/NOPB  [SOT-223-4]

### Blocks framed on the sheet
5V to 3.3V Linear Regulator: C36 C37 TP11 TP19 U12

### Ports
3V3, +5V, -5V, GND

### Nets
3V3: C37.1 D8.1 TP19.TP U12.2(VOUT_2) U12.4(VOUT_4) ; port 3V3
+5V: C7.1 C8.1 C9.1 C36.1 D6.1 Q1.1(D) Q1.2(D) Q1.5(D) Q1.6(D) Q1.8(D) R15.1 TP11.TP U6.1(VIN) U12.3(VIN) ; port +5V
-5V: C9.2 C12.2 C13.2 C14.2 C15.2 C16.2 C18.2 C19.2 C20.2 C21.2 R16.2 R18.2 R20.1 R22.2 R50.2 U6.6(GND) U6.11(CSG) ; port -5V
GND: C7.2 C8.2 C18.1 C19.1 C20.1 C21.1 C36.2 C37.2 D9.1 L5.1 R19.1 R36.2 R37.2 U6.9(OUT) U6.17(EP) U12.1(GND) ; port GND
VCC: C14.1 R17.1 U6.16(VCC)
NetC10_1: C10.1 CR1.2(Base_cathode) L5.2 Q1.4(S) Q1.7(S) U6.13(SW)
NetC10_2: C10.2 U6.15(BOOT)
NetC11_1: C11.1 C17.1 R19.2 R22.1 U6.8(FB)
NetC11_2: C11.2 R21.1
NetC12_1: C12.1 R15.2 R16.1 U6.2(EN)
NetC13_1: C13.1 U6.3(SS)
NetC15_1: C15.1 R17.2 U6.4(RAMP)
NetC16_1: C16.1 U6.10(DITH)
NetC17_2: C17.2 R21.2 U6.7(COMP)
NetCR1_1: CR1.1(Anode) CR1.3(Anode) R18.1 U6.12(CS)
NetD6_2: D6.2 R36.1
NetD8_2: D8.2 R37.1
NetD9_2: D9.2 R50.1
NetQ1_3: Q1.3(G) U6.14(HG)
NetR20_2: R20.2 U6.5(RT/SYNC)

### Notes on the sheet
- Ports
- DWG. NO.
- REV.
- SHT.
- THIS DOCUMENT AND THE DATA DISCLOSED HEREIN OR HEREWITH IS THE PROPERTY OF ALTIUM LIMITED AND MAY BE FREELY DISTRIBUTED IN WHOLE. NO RIGHTS ARE RESERVED OR EXPRESS OR IMPLIED WARANTEE GIVEN.
- REVISION
- DESCRIPTION
- DATE
- APPROVED
- ENG:
- APPROVALS
- PROJECT
- DSN:
- CHK:
- REFERENCE DOCUMENTS
- PROJECT REVISION:
- TITLE
- DOCUMENT REVISION:
- DESIGN ITEM:
- BOM:
- FAB DWG:
- PCB DWG:
- ASSY DWG:
- SCALE:
- SIZE
- B
- CAGE CODE
- FILE NAME
- DWG NO.
- SHEET
- OF
- REV
- (in symbol Title_Block) Underwater Robotics Team / Ohio State University; Sheet; of

### Library data of the parts
*#3 = Title_Block: as *#1 on sheet [Acoustics] Connections & RP2040
C7-C17 C19 = CAPACITOR_1uF_0402: Cap 1uF 16V +/-10% / Ceramic 0402; Made By: Robert Pafford; Tolerance: +/- 10%; Voltage: 16V; Supplier 1: Digikey
  C7 C9: Supplier Part Number 1: 445-9097-1-ND
  C8 C10: Supplier Part Number 1: 399-C0402C104K8PACTUCT-ND
  C11: Supplier Part Number 1: 311-1031-1-ND
  C12: Supplier Part Number 1: 311-3805-1-ND
  C13: Supplier Part Number 1: 490-3253-1-ND
  C14: Supplier Part Number 1: 399-C0402C105K8PACTUCT-ND
  C15: Supplier Part Number 1: 399-C0402C110J5GACTUCT-ND
  C16: Supplier Part Number 1: 311-1722-1-ND
  C17: Supplier Part Number 1: 490-GCM1555C1H820JA16DCT-ND
  C19: Supplier Part Number 1: 445-13820-1-ND
C18 C20 C21 = CAPACITOR_10uF_1206_Tantalum_1: Cap 10uF 16V +/-20% / Tantalum 1206; Tolerance: +/- 10%; Made By: Dylan T; ComponentLink1Description: Digikey; ComponentLink1URL: https://www.digikey.com/en/products/detail/kyocera-avx/F981A106MMA/4004990; Voltage: 16V; Supplier 1: Digikey; Supplier Part Number 1: 478-5800-1-ND
C36 C37 = CAPACITOR_10uF_0603: as C31 on sheet [Acoustics] Connections & RP2040; ComponentLink1Description: Digikey; ComponentLink1URL: https://www.digikey.com/en/products/detail/samsung-electro-mechanics/CL10A106MQ8NNNC/3886777; Supplier 1: Digi-Key; Supplier Part Number 1: 1276-1119-1-ND; Tolerance: +/- 20%; Voltage: 6.3V
CR1 = VS-50WQ04FN-M3: No Description Available; Mfr_Name: Vishay; RefDes: RefDes; Type: Type; Supplier 1: Digikey; Supplier Part Number 1: VS-50WQ04FN-M3-ND
D6 D8 D9 = LED_Green_0603_3V: as D3 on sheet [Acoustics] Connections & RP2040; ComponentLink1Description: Datasheet; ComponentLink1URL: https://www.we-online.de/katalog/datasheet/150060GS75000.pdf; Forward Voltage: 3V; Package: 0603; Supplier 1: Digi-Key; Supplier Part Number 1: 1830-1062-1-ND
L5 = INDUCTOR_15nH_0402: 15 nH Unshielded Multilayer Inductor 250 mA 600mOhm Max 0402 (1005 Metric); Tolerance: +/- 5%; Supplier 1: Digikey; Supplier Part Number 1: 445-6381-1-ND
Q1 = CMP-04962-000051-1: MOSFET N-CH 20V 22A 6SON; Rds On Max: 15mR; Power Dissipation: 2.5W; Turn-Off Delay Time: 9.9ns; Number of Elements: 2; Number of Channels: 1; Turn-On Delay Time: 17.2ns; Input Capacitance: 419pF; Fall Time: 4.1ns; Drain to Source Resistance: 19.2mR; Element Configuration: Single; Contact Plating: Tin; Drain to Source Voltage (Vdss): 20V; Number of Pins: 6; Max Power Dissipation: 2.5W; Min Operating Temperature: -55°C; Max Operating Temperature: 150°C; Packaging: Tape and Reel; Rise Time: 17.2ns; Mount: Surface Mount; Gate to Source Voltage (Vgs): 20V; Drain to Source Breakdown Voltage: 20V; Lead Free: Lead Free; Continuous Drain Current (ID): 22A; Package Quantity: 3000
R15-R22 = RESISTOR_1K_0402: as R31 on sheet [Acoustics] Connections & RP2040; Wattage: 1/16W; Supplier: Digikey; Digikey Part Numer: CR0603-JW-104ELFTR-ND; Supplier 1: Digikey
  R15 R20: Supplier Part Number 1: P10.0KLCT-ND
  R16: Supplier Part Number 1: YAG3150CT-ND
  R17: Supplier Part Number 1: 541-1.00MLCT-ND
  R18: Supplier Part Number 1: P19181CT-ND
  R19: Supplier Part Number 1: P5.23KLCT-ND
  R21: Supplier Part Number 1: P21.5KLCT-ND
  R22: Supplier Part Number 1: 541-1.65KLCT-ND
R36 R37 R50 = RESISTOR_4.7K_0603: as R33 on sheet [Acoustics] Connections & RP2040; Wattage: 1/10W; Supplier: Digikey; Digikey Part Numer: CR0603-JW-104ELFTR-ND; Supplier 1: Digi-Key; Supplier Part Number 1: RMCF0603JT4K70CT-ND
TP11 TP19 = TESTPOINT: Made By: Robert Pafford
U6 = CMP-0063-01290-3: Wide Input Range Non-Synchronous Buck Controller, 16-pin TSSOP-EP, Pb-Free; Manufacturer: Texas Instruments; PowerWise: Y; CompType: MiscPower; PackageTopMarking: NSUZXYTT*L25088*MH-1; Code_JEDEC: MO-153-ABT; PinCount: 16; ComponentLink1Description: Datasheet URL; RoHS: Y; PackageDescription: Molded TSSOP, Jedec, Exposed Pad, 5.0 x 4.4 x 0.9mm Body,16 Lead, 0.65mm Pitch; PackageReference: PWP0016A; ComponentLink1URL: http://www.ti.com/general/docs/lit/getliterature.tsp?genericPartNumber=LM25088&fileType=pdf
U12 = LM1117IMPX-3.3/NOPB: 800-mA 15-V linear voltage regulator 4-SOT-223 -40 to 125; MF: Texas Instruments; Texas_Instruments-Purchase-URL: https://snapeda.com/shop?store=Texas+Instruments&id=410186; Price: None; Mouser-Purchase-URL: https://snapeda.com/shop?store=Mouser&id=410186; MP: LM1117IMPX-3.3/NOPB; Value: *; Availability: Good; Package: SOT-223-4 Texas Instruments; Arrow_Electronics-Purchase-URL: https://snapeda.com/shop?store=Arrow+Electronics&id=410186; SnapEDA_Link: https://www.snapeda.com/parts/LM1117IMPX-3.3/NOPB/Texas%20Instruments/view-part/410186/?ref=snap; DigiKey-Purchase-URL: https://snapeda.com/shop?store=DigiKey&id=410186